# Altium schematic sheet schematic.SchDoc
size A4; SheetNumber: 1; SheetTotal: 1
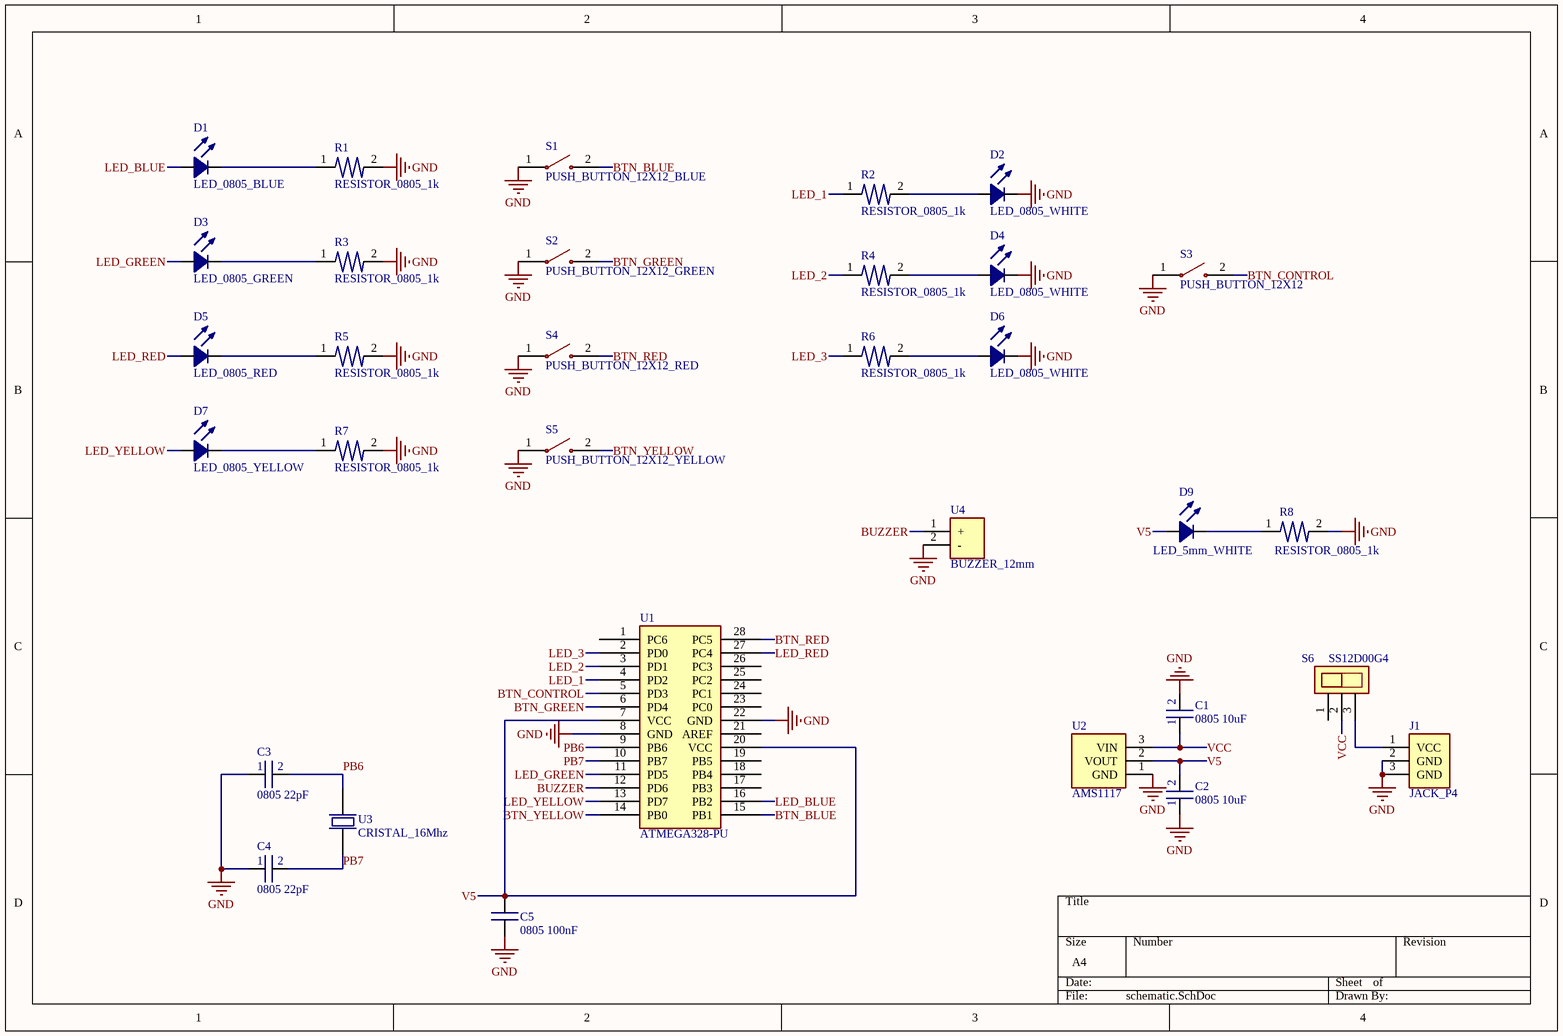
[diagram p0: schematic.SchDoc]

## Parts
C1  0805 10uF  [CAPACITOR 0805]
C2  0805 10uF  [CAPACITOR 0805]
C3  0805 22pF  [CAPACITOR 0805]
C4  0805 22pF  [CAPACITOR 0805]
C5  0805 100nF  [CAPACITOR 0805]
D1  LED_0805_BLUE  [LED_0805_BLUE]
D2  LED_0805_WHITE  [LED_0805_WHITE]
D3  LED_0805_GREEN  [LED_0805_GREEN]
D4  LED_0805_WHITE  [LED_0805_WHITE]
D5  LED_0805_RED  [LED_0805_RED]
D6  LED_0805_WHITE  [LED_0805_WHITE]
D7  LED_0805_YELLOW  [LED_0805_YELLOW]
D9  LED_5mm_WHITE  [LED_5mm_WHITE]
J1  JACK_P4  [JACK_P4]
R1  RESISTOR_0805_1k  [RESISTOR_0805_1k]
R2  RESISTOR_0805_1k  [RESISTOR_0805_1k]
R3  RESISTOR_0805_1k  [RESISTOR_0805_1k]
R4  RESISTOR_0805_1k  [RESISTOR_0805_1k]
R5  RESISTOR_0805_1k  [RESISTOR_0805_1k]
R6  RESISTOR_0805_1k  [RESISTOR_0805_1k]
R7  RESISTOR_0805_1k  [RESISTOR_0805_1k]
R8  RESISTOR_0805_1k  [RESISTOR_0805_1k]
S1  PUSH_BUTTON_12X12_BLUE  [PUSH_BUTTON_12X12_BLUE]
S2  PUSH_BUTTON_12X12_GREEN  [PUSH_BUTTON_12X12_GREEN]
S3  PUSH_BUTTON_12X12  [PUSH_BUTTON_12X12_WHITE]
S4  PUSH_BUTTON_12X12_RED  [PUSH_BUTTON_12X12_RED]
S5  PUSH_BUTTON_12X12_YELLOW  [PUSH_BUTTON_12X12_YELLOW]
S6  SS12D00G4  [SS12D00G4]
U1  ATMEGA328-PU  [ATMEGA328-PU]
U2  AMS1117  [AMS1117]
U3  CRISTAL_16Mhz  [CRISTAL_16Mhz]
U4  BUZZER_12mm  [BUZZER_12mm]

## Nets
GND: C1.2 C2.1 C3.1 C4.1 C5.2 D2.2 D4.2 D6.2 J1.2(GND) J1.3(GND) R1.2 R3.2 R5.2 R7.2 R8.2 S1.1 S2.1 S3.1 S4.1 S5.1 U1.8(GND) U1.22(GND) U2.1(GND) U4.2(-)
BTN_BLUE: S1.2 U1.15(PB1)
BTN_CONTROL: S3.2 U1.5(PD3)
BTN_GREEN: S2.2 U1.6(PD4)
BTN_RED: S4.2 U1.28(PC5)
BTN_YELLOW: S5.2 U1.14(PB0)
BUZZER: U1.12(PD6) U4.1(+)
LED_1: R2.1 U1.4(PD2)
LED_2: R4.1 U1.3(PD1)
LED_3: R6.1 U1.2(PD0)
LED_BLUE: D1.1 U1.16(PB2)
LED_GREEN: D3.1 U1.11(PD5)
LED_RED: D5.1 U1.27(PC4)
LED_YELLOW: D7.1 U1.13(PD7)
PB6: C3.2 U1.9(PB6) U3.2
PB7: C4.2 U1.10(PB7) U3.1
V5: C2.2 C5.1 D9.1 U1.7(VCC) U1.20(VCC) U2.2(VOUT)
VCC: C1.1 S6.2 U2.3(VIN)
NetD1_2: D1.2 R1.1
NetD2_1: D2.1 R2.2
NetD3_2: D3.2 R3.1
NetD4_1: D4.1 R4.2
NetD5_2: D5.2 R5.1
NetD6_1: D6.1 R6.2
NetD7_2: D7.2 R7.1
NetD9_2: D9.2 R8.1
NetJ1_1: J1.1(VCC) S6.3

Not connected (* = marked no-connect by the designer): S6 1; U1 1(PC6) 17(PB3) 18(PB4) 19(PB5) 21(AREF) 23(PC0) 24(PC1) 25(PC2) 26(PC3)

## Library data of the parts
C1-C5 = CAPACITOR 0805
S1 S2 S4 S5 = PUSH_BUTTON_12X12
U1 = ATMEGA328-PU: Microcontroller 8-bit 20MHz  Flash 32KB DIP-28; ComponentLink1Description: Datasheet; ComponentLink1URL: https://www.mouser.com/datasheet/2/268/ATmega48A_PA_88A_PA_168A_PA_328_P_DS_DS40002061B-3050139.pdf; Mouser PN: 556-ATMEGA328P-PU; Digikey PN: ATMEGA328P-PU-ND
U2 = AMS1117: IC REG LINEAR 1A SOT-89-3L; ComponentLink1Description: Datasheet; ComponentLink1URL: http://www.advanced-monolithic.com/pdf/ds1117.pdf; Digikey PN: 4518-AMS1117-3.3CT-ND
U3 = CRISTAL_16Mhz: CRYSTAL 16MHZ PTH; Mouser PN: 449-LFXTAL022786BULK; Digikey PN: 3155-16M20P2/49US-ND
U4 = BUZZER_12mm: BUZZER MAGNETIC 12MM; Digikey PN: 433-WT-1209T-ND; Mouser PN: 433-WT-1209T-ND